# Altium project iobrd_dig.PrjPcb
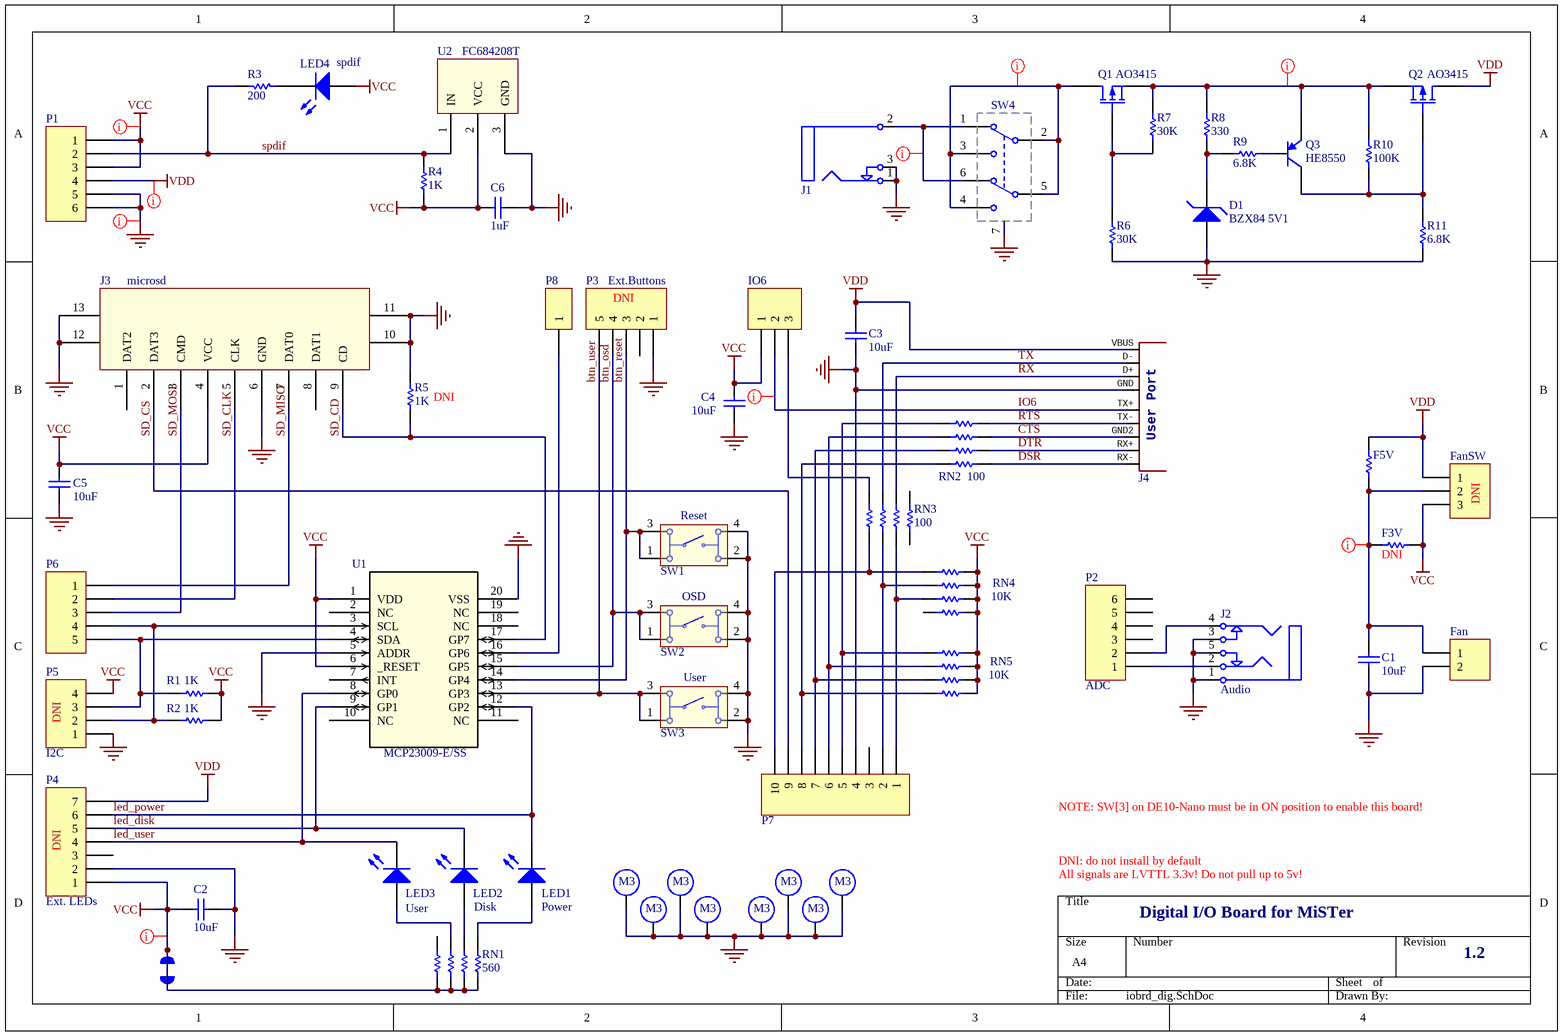
[diagram p0: iobrd_dig.SchDoc]
1 sheet, 62 parts. Net scope: global (net labels, ports and power ports of the same name join across sheets).
Board file: iobrd_dig.PcbDoc

## Sheet iobrd_dig.SchDoc
size A4

### Parts
C1  value 10uF  [C0805]  (hidden comment: C0805)
C2  value 10uF  [C0805]  (hidden comment: C0805)
C3  value 10uF  [C0805]  (hidden comment: C0805)
C4  value 10uF  [C0805]  (hidden comment: C0805)
C5  value 10uF  [C0805]  (hidden comment: C0805)
C6  value 1uF  [C0805]  (hidden comment: C0805)
CUT1  CUT  [CUT]  (value not drawn)
D1  BZX84 5V1  [SOT-23B_N]
F3V  0  [R0805 - DNI]  (value not drawn)
F5V  0  [R0805]  (value not drawn)
Fan  Header 2  [HDR1X2]  (value not drawn)
FanSW  Header 3  [HDR1X3]  (value not drawn)
H1  (no value)  [M3]
H2  (no value)  [M3]
H3  (no value)  [M3]
H4  (no value)  [M3]
H5  (no value)  [M3]
H6  (no value)  [M3]
H7  (no value)  [M3]
H8  (no value)  [M3]
IO6  Header 3  [HDR1X3]  (value not drawn)
J1  *  [PWR-2mm]  (value not drawn)
J2  Audio  [phonejack]
J3  microsd  [microsd]
J4  User Port  [USB3-A-F-PTH]
LED1  Power  [LEDR]
LED2  Disk  [LEDG]
LED3  User  [LEDY]
LED4  spdif  [LEDR_angle]
P1  (no value)  [HDR1X6]
P2  ADC  [HDR1X6]
P3  Ext.Buttons  [HDR5]
P4  Ext. LEDs  [HDR7]
P5  I2C  [HDR1X4]
P6  Header 5  [HDR1X5]  (value not drawn)
P7  Header 10  [HDR1X10]  (value not drawn)
P8  Header 1  [Header 1]  (value not drawn)
Q1  AO3415  [SOT-23B_N]
Q2  AO3415  [SOT-23B_N]
Q3  HE8550  [SOT-23B_N]
R1  1K  [R0805]
R2  1K  [R0805]
R3  200  [R0805]
R4  1K  [R0805]
R5  1K  [R0805 - DNI]
R6  30K  [R0805]
R7  30K  [R0805]
R8  330  [R0805]
R9  6.8K  [R0805]
R10  100K  [R0805]
R11  6.8K  [R0805]
RN1  560  [RA1206]
RN2  100  [RA1206]
RN3  100  [RA1206]
RN4  10K  [RA1206]
RN5  10K  [RA1206]
SW1  Reset  [tact 12x12]
SW2  OSD  [tact 12x12]
SW3  User  [tact 12x12]
SW4  POWER  [SW DPDT]  (value not drawn)
U1  MCP23009-E/SS  [SSOP20_MC]
U2  FC684208T  [TOSLINK]

### Nets
GND: C1.1 C2.1 C3.1 C4.1 C5.1 C6.1 D1.1(A) Fan.2 H1.1 H2.1 H3.1 H4.1 H5.1 H6.1 H7.1 H8.1 J1.1 J1.3 J2.1 J2.3 J2.5 J3.6(GND) J3.10(GND) J3.11(GND) J3.12(GND) J3.13(GND) J4.GND P1.5 P1.6 P3.1 P4.2 P5.1 P7.4 R5.2 R6.1 R11.1 SW1.2 SW1.4 SW2.2 SW2.4 SW3.2 SW3.4 SW4.7 U1.5(ADDR) U1.20(VSS) U2.0 U2.3(GND)
VCC: C2.2 C4.2 C5.2 C6.2 CUT1.1 F3V.1 FanSW.3 IO6.1 J3.4(VCC) LED4.2(A) P1.1 P1.3 P4.1 P5.4 R1.2 R2.1 R4.1 RN1.2 RN1.4 RN1.6 RN1.8 RN4.2 RN4.4 RN4.6 RN4.8 RN5.1 RN5.3 RN5.5 RN5.7 U1.1(VDD) U1.6(_RESET) U2.2(VCC)
VDD: C3.2 F5V.1 FanSW.1 J4.VBUS P1.4 P4.7 Q2.3(D)
btn_osd: P3.4 SW2.1 SW2.3 U1.15(GP5)
btn_reset: P3.3 SW1.1 SW1.3 U1.14(GP4)
btn_user: P3.5 SW3.1 SW3.3 U1.13(GP3)
CTS: J4.GND2 RN2.5
DSR: J4.RX- RN2.1
DTR: J4.RX+ RN2.3
IO6: IO6.2 J4.TX+
led_disk: LED2.1(K) P4.5 U1.9(GP1)
led_power: LED1.1(K) P4.6 U1.12(GP2)
led_user: LED3.1(K) P4.4 U1.8(GP0)
RTS: J4.TX- RN2.7
RX: J4.D+ RN3.5
SD_CD: J3.9(CD) R5.1 U1.17(GP7)
SD_CLK: J3.5(CLK) P6.2
SD_CS: J3.2(DAT3) P7.9
SD_MISO: J3.7(DAT0) P6.1
SD_MOSI: J3.3(CMD) P6.3
spdif: P1.2 R3.2 R4.2 U2.1(IN)
TX: J4.D- RN3.3
NetC1_2: C1.2 F3V.2 F5V.2 Fan.1 FanSW.2
NetD1_3: D1.3(K) R8.1 R9.2
NetIO6_3: IO6.3 RN3.1
NetJ1_2: J1.2 SW4.1(NC1) SW4.6(NC2)
NetJ2_2: J2.2 P2.1
NetJ2_4: J2.4 P2.2
NetLED1_2: LED1.2(A) RN1.1
NetLED2_2: LED2.2(A) RN1.3
NetLED3_2: LED3.2(A) RN1.5
NetLED4_1: LED4.1(K) R3.1
NetP5_2: P5.2 P6.4 R2.2 U1.3(SCL)
NetP5_3: P5.3 P6.5 R1.1 U1.4(SDA)
NetP7_1: P7.1 RN3.6 RN4.5
NetP7_2: P7.2 RN3.4 RN4.3
NetP7_5: P7.5 RN2.8 RN5.8
NetP7_6: P7.6 RN2.6 RN5.6
NetP7_7: P7.7 RN2.4 RN5.4
NetP7_8: P7.8 RN2.2 RN5.2
NetP7_10: P7.10 RN3.2 RN4.1
NetP8_1: P8.1 U1.16(GP6)
NetQ1_1: Q1.1(G) R6.2 R7.1
NetQ1_2: Q1.2(S) Q2.2(S) Q3.2(E) R7.2 R8.2 R10.2
NetQ1_3: Q1.3(D) SW4.2(COMMON1) SW4.3(NO1) SW4.4(NO2) SW4.5(COMMON2)
NetQ2_1: Q2.1(G) Q3.3(C) R10.1 R11.2
NetQ3_1: Q3.1(B) R9.1

Not connected (* = marked no-connect by the designer): J3 1(DAT2) 8(DAT1); P2 3 4 5 6; P3 2; P4 3; P7 3; RN1 7; RN3 7 8; RN4 7; U1 2(NC) 7(INT) 10(NC) 11(NC) 18(NC) 19(NC)

### Layout directives
net class power: GND, IO6, NetC1_2, NetJ1_2, NetQ1_2, NetQ1_3, VCC, VDD

### Notes on the sheet
- (near P3) DNI
- (near R5) DNI
- (near FanSW) DNI
- (near F3V) DNI
- (near P5) DNI
- (near P4) DNI
- NOTE: SW[3] on DE10-Nano must be in ON position to enable this board!
- DNI: do not install by default
- All signals are LVTTL 3.3v! Do not pull up to 5v!
- Digital I/O Board for MiSTer
- 1.2

### Library data of the parts
C1-C6 = C0805: Ceramic Chip Capacitor - Standard; Note: Footprint corresponds to dimensions for bulk cassette packaging. This case size has tightened tolerances.; Published: 17-Jul-2002; LatestRevisionDate: 19-Mar-2004; LatestRevisionNote: Silkscreen size reduced.; DatasheetDocument: Mar-2001; PackageDocument: Mar-2001; PackageReference: 0805; Publisher: Altium Limited; Code_JEITA: 0805; Code_IPC: 2012[0805]; ComponentLink1Description: Manufacturer Link; ComponentLink1URL: http://www.kemet.com/; ComponentLink2Description: Datasheet; ComponentLink2URL: http://www.kemet.com/kemet/web/homepage/kechome.nsf/vapubfilesname/F3102TA.pdf/$file/F3102TA.pdf
D1 = BZX84: Diode Zener; Published: 8-Jun-2000; LatestRevisionDate: 17-Jul-2002; LatestRevisionNote: Re-released for DXP Platform.; PackageVersion: Sep-1996; PackageReference: SMC; Publisher: Altium Limited; PackageDescription: DO-214-AB/SMC; 2 C-Bend Leads; Body 7.9 x 5.9 mm, inc. leads (LxW); Code_JEDEC: DO-214-AB
F3V F5V R1-R11 = ERJ6RS: Low Ohmic Value Thick Film Chip Resistor, 0.1 Ohm to 0.2 Ohm Range, 1%, 2% and 5% Tolerance, 0805 Size, 0.125 W; Published: 17-Dec-2003; LatestRevisionDate: 19-Mar-2004; LatestRevisionNote: Silkscreen size reduced.; PackageDocument: Mar-2003; PackageReference: 6-0805; Publisher: Altium Limited; Code_IPC: 2012 [0805]; ComponentLink1Description: Manufacturer Link; ComponentLink1URL: http://www.panasonic.com/industrial/components/resistive_products.htm; ComponentLink2Description: Datasheet; ComponentLink2URL: http://www.panasonic.com/industrial/components/pdf/AOA0000CE3.pdf
Fan = Header 2: Header, 2-Pin; LatestRevisionDate: 17-Jul-2002; LatestRevisionNote: Re-released for DXP Platform.; Publisher: Altium Limited
FanSW IO6 = Header 3: Header, 3-Pin; LatestRevisionDate: 17-Jul-2002; LatestRevisionNote: Re-released for DXP Platform.; Publisher: Altium Limited
H1-H8 = M3
J1 = Powerjack
J2 = phonejack
J4 = USBA30-PTH: USB: User Port
LED1-LED4 = 151031SS04000: THT LED round mono-color color lens, WL-TMRW, Super Red; PackageReference: Type 3mm; Emitting color: Super Red; PartNumber: 151031SS04000; ComponentLink1Description: Manufacturer URL; ComponentLink1URL: http://www.we-online.com; ComponentLink2Description: Datasheet; ComponentLink2URL: http://katalog.we-online.de/pbs/datasheet/7448042001.pdfhttp://katalog.we-online.de/pbs/datasheet/7448042001.pdfhttp://katalog.we-online.de/pbs/datasheet/7448042001.pdfhttp://katalog.we-online.de/pbs/datasheet/151031SS04000.pdf
P1 P2 = Header 6: Header, 6-Pin; LatestRevisionDate: 17-Jul-2002; LatestRevisionNote: Re-released for DXP Platform.; Publisher: Altium Limited
P3 P6 = Header 5: Header, 5-Pin; LatestRevisionDate: 17-Jul-2002; LatestRevisionNote: Re-released for DXP Platform.; Publisher: Altium Limited
P4 = Header 7: Header, 7-Pin; LatestRevisionDate: 17-Jul-2002; LatestRevisionNote: Re-released for DXP Platform.; Publisher: Altium Limited
P5 = Header 4: Header, 4-Pin; LatestRevisionDate: 17-Jul-2002; LatestRevisionNote: Re-released for DXP Platform.; Publisher: Altium Limited
P7 = Header 10: Header, 10-Pin; LatestRevisionDate: 17-Jul-2002; LatestRevisionNote: Re-released for DXP Platform.; Publisher: Altium Limited
Q1 Q2 = AO3415: P-Channel MOSFET; Published: 8-Jun-2000; LatestRevisionDate: 17-Jul-2002; LatestRevisionNote: Re-released for DXP Platform.; PackageVersion: 1995/1996; PackageReference: E3; Publisher: Altium Limited; PackageDescription: TO, Flat Index; 3 In-Line, Axial Leads; Body Dia. 4.6mm; Lead Dia. 0.5 mm (max)
Q3 = HE8550: PNP Bipolar Transistor; Published: 8-Jun-2000; LatestRevisionDate: 29-May-2009; LatestRevisionNote: IPC-7351 Footprint Added.; PackageVersion: Aug-1999; PackageReference: SOT-23B; Publisher: Altium Limited; PackageDescription: 3-Pin SOT-23 Package 0.95 mm Pitch, 2.4 mm Lead Span
RN1-RN5 = resistor_set
SW1-SW3 = tact 12x12
SW4 = SW DPDT
U1 = MCP23009-E/SS: MCP23009; Vendor: Microchip; Built_By: EMA_UL_Team; Manufacturer_Part_Number: MCP23009-E/SS; Copyright: Copyright (C) 2018 Accelerated Designs. All rights reserved; RefDes: RefDes; Type: DEV; Value: Value
U2 = Toslink